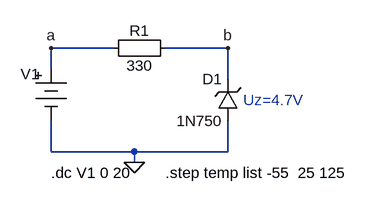
[diagram p0: schematic zener_low_voltage.asc]
zener_low_voltage.asc, the LTspice schematic file:
Version 4
SHEET 1 880 680
WIRE 112 -256 16 -256
WIRE 288 -256 192 -256
WIRE 16 -224 16 -256
WIRE 288 -208 288 -256
WIRE 16 -96 16 -144
WIRE 144 -96 16 -96
WIRE 288 -96 288 -144
WIRE 288 -96 144 -96
WIRE 144 -80 144 -96
FLAG 144 -80 0
FLAG 288 -256 b
FLAG 16 -256 a
SYMBOL Misc\\battery 16 -240 R0
WINDOW 123 0 0 Left 2
WINDOW 39 0 0 Left 2
WINDOW 0 -47 24 Left 2
WINDOW 3 -45 72 Left 2
SYMATTR InstName V1
SYMATTR Value ""
SYMBOL Misc\\EuropeanResistor 208 -272 R90
WINDOW 0 5 56 VBottom 2
WINDOW 3 27 56 VTop 2
SYMATTR InstName R1
SYMATTR Value 330
SYMBOL zener 304 -144 R180
WINDOW 0 24 64 Left 2
WINDOW 3 24 0 Left 2
SYMATTR InstName D1
SYMATTR Value 1N750
TEXT 16 -64 Left 2 !.dc V1 0 20
TEXT 192 -64 Left 2 !.step temp list -55  25 125
TEXT 312 -176 Left 2 ;Uz=4.7V

The netlist it stands for:
* zener_low_voltage.asc
V1 a 0
R1 b a 330
D1 0 b 1N750
.model D D
.lib standard.dio
.dc V1 0 20
.step temp list -55  25 125
* Uz=4.7V
.backanno
.end